# EAGLE design brick_i2c_gpio (EAGLE 7.4.0)
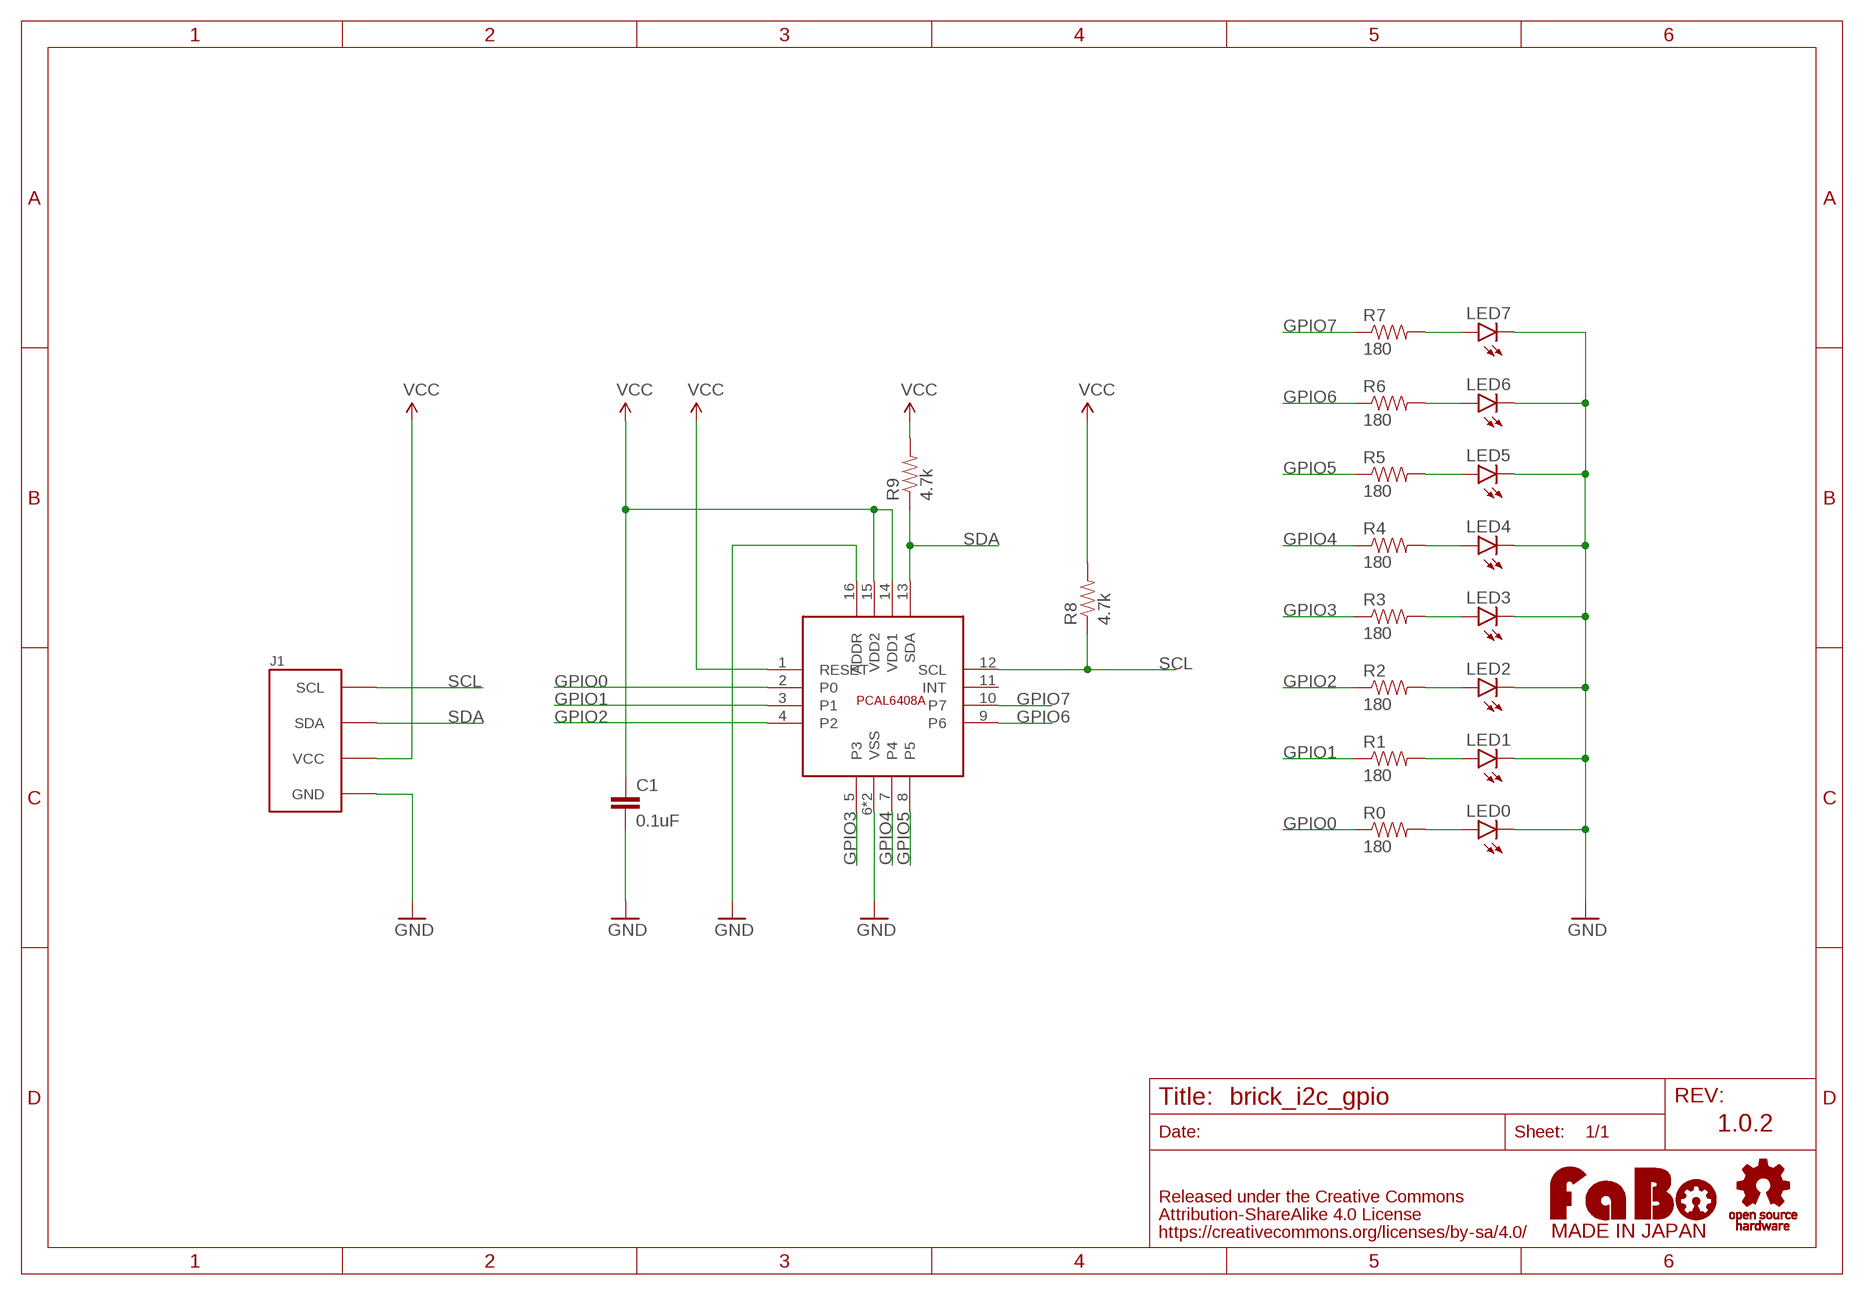
[diagram p0: schematic, sheet 1]

## Parts
C1  0.1uF  CAP-EIA0603  [EIA0603]
J1  BRICK_I2C  [BRICK_I2C]
LED0  LED-EIA0603  [EIA0603-LED]
LED1  LED-EIA0603  [EIA0603-LED]
LED2  LED-EIA0603  [EIA0603-LED]
LED3  LED-EIA0603  [EIA0603-LED]
LED4  LED-EIA0603  [EIA0603-LED]
LED5  LED-EIA0603  [EIA0603-LED]
LED6  LED-EIA0603  [EIA0603-LED]
LED7  LED-EIA0603  [EIA0603-LED]
R0  180  RES-EIA0603  [EIA0603]
R1  180  RES-EIA0603  [EIA0603]
R2  180  RES-EIA0603  [EIA0603]
R3  180  RES-EIA0603  [EIA0603]
R4  180  RES-EIA0603  [EIA0603]
R5  180  RES-EIA0603  [EIA0603]
R6  180  RES-EIA0603  [EIA0603]
R7  180  RES-EIA0603  [EIA0603]
R8  4.7k  RES-EIA0603  [EIA0603]
R9  4.7k  RES-EIA0603  [EIA0603]
U$2  LOGO_OSHW-T_M  [LOGO_OSHW_T_M]
U$4  LOGO_FABO-M  [LOGO_FABO_M]
U$5  NX-PCAL6408A  [NXP-PCAL6408A]

## Nets
GND: C1.2 J1.GND LED0.C LED1.C LED2.C LED3.C LED4.C LED5.C LED6.C LED7.C U$5.6(VSS) U$5.16(ADDR) U$5.17(VSS)
GPIO0: R0.1 U$5.2(P0)
GPIO1: R1.1 U$5.3(P1)
GPIO2: R2.1 U$5.4(P2)
GPIO3: R3.1 U$5.5(P3)
GPIO4: R4.1 U$5.7(P4)
GPIO5: R5.1 U$5.8(P5)
GPIO6: R6.1 U$5.9(P6)
GPIO7: R7.1 U$5.10(P7)
N$1: LED7.A R7.2
N$2: LED6.A R6.2
N$3: LED5.A R5.2
N$4: LED4.A R4.2
N$5: LED3.A R3.2
N$6: LED2.A R2.2
N$7: LED1.A R1.2
N$8: LED0.A R0.2
SCL: J1.SCL R8.1 U$5.12(SCL)
SDA: J1.SDA R9.1 U$5.13(SDA)
VCC: C1.1 J1.VCC R8.2 R9.2 U$5.1(RESET) U$5.14(VDD1) U$5.15(VDD2)
Unconnected: U$5.11(INT)

## Notes on the sheet
- 1.0.2

## Library data of the parts
C1 = FaBo-etc:CAP: Capacitor Standard 0603 ceramic capacitor
J1 = gclue:BRICK_I2C: FaBo Brick 4pin(I2C)
LED0 LED1-LED7 = FaBo-etc:LED: LED
R0 R1-R9 = FaBo-etc:RES
U$2 = FaBo-etc:LOGO_OSHW
U$4 = FaBo-etc:LOGO_FABO
U$5 = FaBo-Mems:NX-PCAL6408A: NXP PCAL6408A

## Board
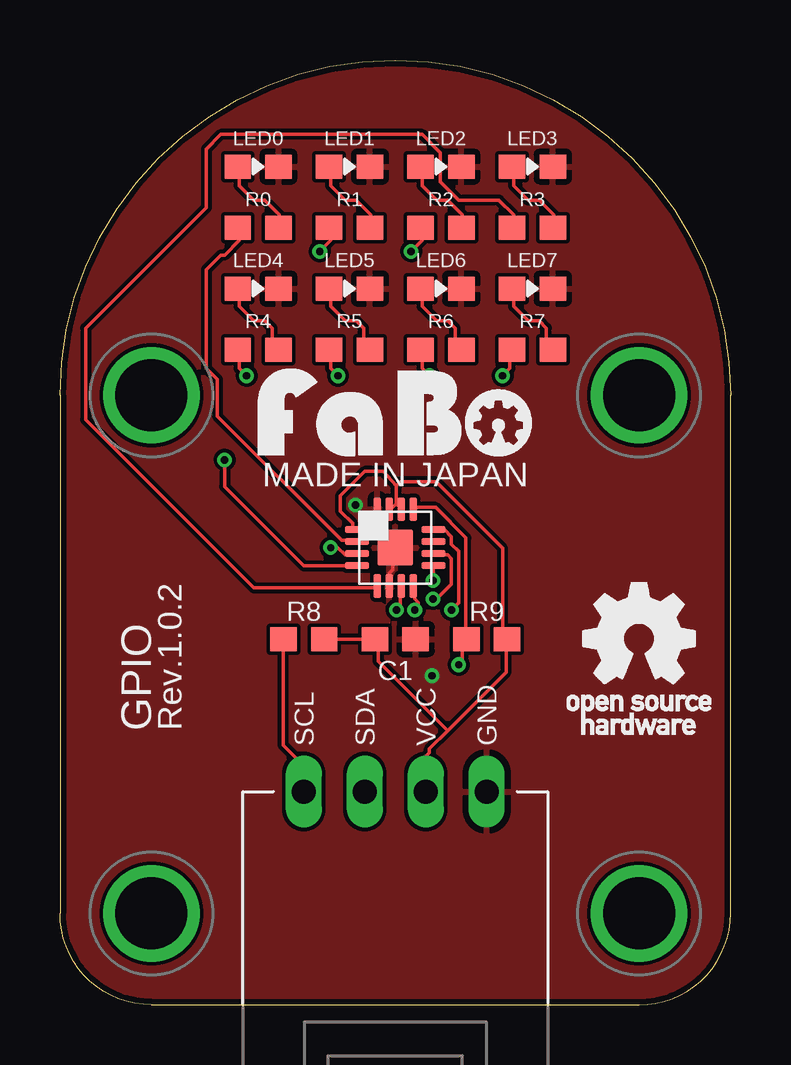
[diagram p1: board, top side]
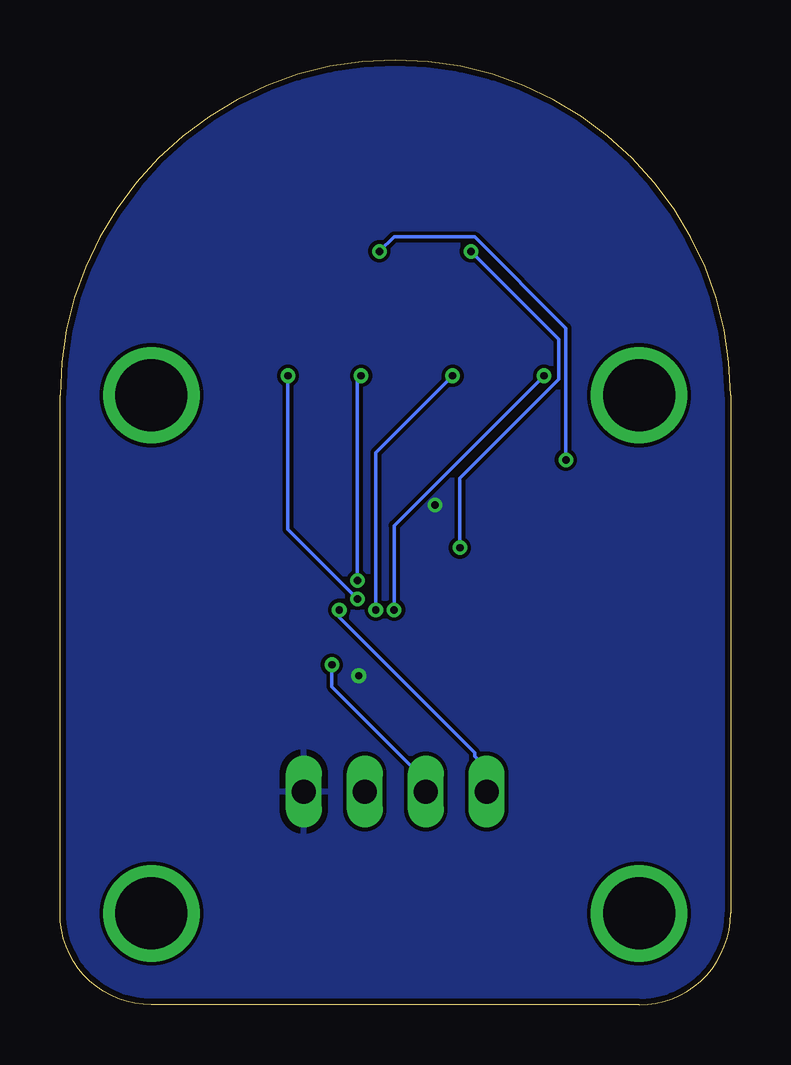
[diagram p2: board, bottom side, seen from below]

Size 27.94 x 39.37 mm. Coordinates in mm from the lower left corner, seen from the top.
Copper layers (1*16): Top 0.035mm / dielectric 1.5mm / Bottom 0.035mm
Design rules "Elecrow_2-layer_eagle_rule": minimum track width 6mil, minimum drill 12mil, track to track 6mil, track to pad 6mil, pad to pad 6mil, via to via 6mil, smd to smd 0mil, copper to edge 10mil, drill to drill 10mil, minimum pad ring 10mil, minimum via ring 6mil, stop-mask expansion 2mil, vias tented up to drill 100mil, thermal gap 10mil

### Footprints (pad centres in the part's own frame; a part is rotated, then mirrored left to right if it is on the bottom)
EIA0603 = smd 1.1 x 1: 1 -0.85,0; 2 0.85,0
BRICK_I2C = drill 1 long: GND 3.81,-10.16; SCL -3.81,-10.16; SDA -1.27,-10.16; VCC 1.27,-10.16 | drill 3 pad 3.81: P$1 -10.16,6.35; P$2 10.16,6.35; P$3 -10.16,-15.24; P$4 10.16,-15.24
EIA0603-LED = smd 1.1 x 1: A -0.85,0; C 0.85,0
NXP-PCAL6408A = smd 1 x 0.3: 1 -1.6,0.75; 2 -1.6,0.25; 3 -1.6,-0.25; 4 -1.6,-0.75; 9 1.6,-0.75; 10 1.6,-0.25; 11 1.6,0.25; 12 1.6,0.75 | smd 0.3 x 1: 5 -0.75,-1.6; 6 -0.25,-1.6; 7 0.25,-1.6; 8 0.75,-1.6; 13 0.75,1.6; 14 0.25,1.6; 15 -0.25,1.6; 16 -0.75,1.6 | smd 1.5 x 1.5: 17 0,0

### Placement (x,y rotation side)
C1  13.97,15.24 0 top
J1  13.97,19.05 0 top
LED0  8.26,34.92 0 top
LED1  12.06,34.92 0 top
LED2  15.88,34.92 0 top
LED3  19.68,34.92 0 top
LED4  8.26,29.84 0 top
LED5  12.06,29.84 0 top
LED6  15.88,29.84 0 top
LED7  19.68,29.84 0 top
R0  8.26,32.38 0 top
R1  12.06,32.38 0 top
R2  15.88,32.38 0 top
R3  19.68,32.38 0 top
R4  8.26,27.3 0 top
R5  12.06,27.3 0 top
R6  15.88,27.3 0 top
R7  19.68,27.3 0 top
R8  10.16,15.24 0 top
R9  17.78,15.24 0 top
U$2  24.13,15.24 0 top
U$4  13.97,22.86 0 top
U$5  13.97,19.05 0 top

### Tracks (layer width: path | path; a pad name or v marks a point on that pad's centre or on a via)
GND  (via drill 0.3)
  Top 0.152: U$5.6 13.72,17.53 13.72,17.98 13.87,18.14 13.87,19.05 U$5.17 13.46,19.56 13.46,19.68 13.21,19.94 13.21,20.65 U$5.16
  other vias: 12.32,20.83 15.49,13.72
  pour Bottom: -1.27,-1.27 29.21,-1.27 29.21,40.64 -1.27,40.64
  pour Top: -1.27,-1.27 29.21,-1.27 29.21,40.64 -1.27,40.64
GPIO0
  Top 0.152: U$5.2 12.34,19.36 11.73,19.36 6.55,24.54 6.55,26.06 6.1,26.52 6.1,30.63 6.71,31.24 6.86,31.24 7.47,31.85 7.47,32.31 R0.1
GPIO1  (via drill 0.3)
  Top 0.152: v11.28,19.05 11.58,19.05 11.89,18.75 12.34,18.75 U$5.3 | v10.82,31.39 11.28,31.85 11.28,32.31 R1.1
  Bottom 0.152: v11.28,19.05 11.28,21.95 7.16,26.06 7.16,27.74 v10.82,31.39
GPIO2  (via drill 0.3)
  Top 0.152: v6.86,22.71 6.86,21.59 10.16,18.29 12.34,18.29 U$5.4 | v14.63,31.39 15.09,31.85 15.09,32.31 R2.1
  Bottom 0.152: v6.86,22.71 6.86,28.19 10.67,32 14.02,32 v14.63,31.39
GPIO3
  Top 0.152: U$5.5 13.11,17.37 8.08,17.37 1.07,24.38 1.07,28.19 6.1,33.22 6.1,35.66 6.71,36.27 15.09,36.27 15.85,35.51 15.85,34.29 16.61,33.53 18.29,33.53 18.9,32.92 18.9,32.46 R3.1
GPIO4  (via drill 0.3)
  Top 0.152: v14.02,16.46 14.17,16.61 14.17,17.37 U$5.7 | v7.77,26.21 7.47,26.52 7.47,27.28 R4.1
  Bottom 0.152: v14.02,16.46 14.02,19.96 v7.77,26.21
GPIO5  (via drill 0.3)
  Top 0.152: v14.78,16.46 14.94,16.61 14.94,16.76 14.78,16.92 14.78,17.37 U$5.8 | v11.58,26.21 11.28,26.52 11.28,27.28 R5.1
  Bottom 0.152: v14.78,16.46 14.78,23.01 v11.58,26.21
GPIO6  (via drill 0.3)
  Top 0.152: v15.54,17.68 15.54,18.29 U$5.9 | v15.39,26.21 15.09,26.52 15.09,27.28 R6.1
  Bottom 0.152: v15.54,17.68 15.54,26.06 v15.39,26.21
GPIO7  (via drill 0.3)
  Top 0.152: v15.54,16.92 15.7,16.92 16.31,17.53 16.31,18.59 16.15,18.75 15.7,18.75 U$5.10 | v18.44,26.21 18.75,26.52 18.75,27.28 R7.1
  Bottom 0.152: v15.54,16.92 18.44,19.81 v18.44,26.21
N$1
  Top 0.152: LED7.A 18.9,29.72 18.9,29.11 19.51,28.5 19.96,28.5 20.27,28.19 20.27,27.58 20.42,27.43 R7.2
N$2
  Top 0.152: LED6.A 15.09,29.72 15.09,29.11 15.7,28.5 16.15,28.5 16.46,28.19 16.46,27.58 16.61,27.43 R6.2
N$3
  Top 0.152: LED5.A 11.28,29.72 11.28,29.11 11.89,28.5 12.34,28.5 12.65,28.19 12.65,27.58 12.8,27.43 R5.2
N$4
  Top 0.152: LED4.A 7.47,29.72 7.47,29.11 8.08,28.5 8.53,28.5 8.84,28.19 8.84,27.58 8.99,27.43 R4.2
N$5
  Top 0.152: LED3.A 18.9,34.9 18.9,34.14 19.51,33.53 19.96,33.53 20.57,32.92 20.57,32.46 R3.2
N$6
  Top 0.152: LED2.A 15.09,34.9 15.09,34.14 15.7,33.53 16.15,33.53 16.76,32.92 16.76,32.46 R2.2
N$7
  Top 0.152: LED1.A 11.28,34.9 11.28,34.14 11.89,33.53 12.34,33.53 12.95,32.92 12.95,32.46 R1.2
N$8
  Top 0.152: LED0.A 7.47,34.9 7.47,34.14 8.08,33.53 8.53,33.53 9.14,32.92 9.14,32.46 R0.2
SCL  (via drill 0.3)
  Top 0.152: v16.31,16.46 16.61,16.76 16.61,18.9 16.31,19.2 16.31,19.51 16,19.81 15.7,19.81 U$5.12 | R8.1 9.3,15.24 9.3,10.82 10.06,10.06 10.06,8.99 J1.SCL
  Bottom 0.152: v16.31,16.46 16.31,16.15 10.67,10.52 10.67,10.36 10.21,9.91 10.21,8.99 J1.SCL
SDA  (via drill 0.3)
  Top 0.152: 16.92,15.24 16.92,19.46 15.65,20.73 14.78,20.73 U$5.13 | v16.61,14.17 16.76,14.33 16.76,15.09 16.92,15.24 | 16.92,15.24 R9.1
  Bottom 0.152: v16.61,14.17 16.61,13.26 12.8,9.45 12.8,8.99 J1.SDA
VCC
  Top 0.152: 14.02,21.64 13.46,22.23 12.7,22.23 11.68,21.21 11.68,20.57 12.19,20.07 12.19,19.81 U$5.1 | 14.02,20.88 14.02,21.64 | 14.02,20.88 13.87,20.73 U$5.15 | 14.02,20.88 14.17,20.73 U$5.14 | R8.2 C1.1 13.26,15.24 13.26,14.33 16.15,11.43 | 18.59,15.24 18.59,13.87 16.15,11.43 | 16.15,11.43 15.39,10.67 15.39,10.52 15.24,10.36 J1.VCC | 14.02,21.64 14.17,21.79 15.67,21.79 18.44,19.02 18.44,15.39 18.59,15.24 | 18.59,15.24 R9.2

### Text on the board
tPlace: MADE IN JAPAN | GPIO | Rev.1.0.2